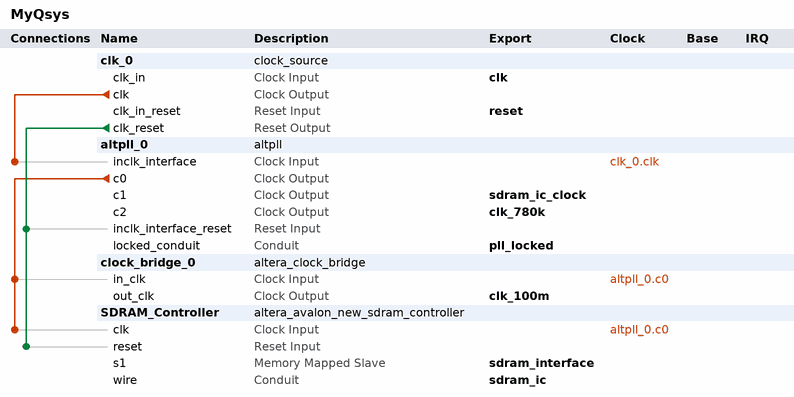
[diagram p0: system contents]
# Platform Designer (Qsys) system MyQsys, MAX 10 10M50DAF484C7G
# Parameters at their usual value, and those the tool derives, are not listed.
package require -exact qsys 16.1
create_system MyQsys
set_project_property DEVICE_FAMILY {MAX 10}
set_project_property DEVICE 10M50DAF484C7G

add_instance clk_0 clock_source 16.1
set_instance_parameter_value clk_0 clockFrequency 50000000

add_instance altpll_0 altpll 16.1
set_instance_parameter_value altpll_0 CLK0_DIVIDE_BY 1
set_instance_parameter_value altpll_0 CLK0_MULTIPLY_BY 2
set_instance_parameter_value altpll_0 CLK1_DIVIDE_BY 1
set_instance_parameter_value altpll_0 CLK1_DUTY_CYCLE 50
set_instance_parameter_value altpll_0 CLK1_MULTIPLY_BY 2
set_instance_parameter_value altpll_0 CLK1_PHASE_SHIFT -2500
set_instance_parameter_value altpll_0 CLK2_DIVIDE_BY 64
set_instance_parameter_value altpll_0 CLK2_DUTY_CYCLE 50
set_instance_parameter_value altpll_0 CLK2_MULTIPLY_BY 1
set_instance_parameter_value altpll_0 CLK2_PHASE_SHIFT 0
set_instance_parameter_value altpll_0 INCLK0_INPUT_FREQUENCY 20000
set_instance_parameter_value altpll_0 PORT_ARESET PORT_UNUSED
set_instance_parameter_value altpll_0 PORT_LOCKED PORT_USED
set_instance_parameter_value altpll_0 PORT_clk1 PORT_USED
set_instance_parameter_value altpll_0 PORT_clk2 PORT_USED
set_instance_parameter_value altpll_0 PORT_clk3 PORT_UNUSED

add_instance clock_bridge_0 altera_clock_bridge 16.1
set_instance_parameter_value clock_bridge_0 DERIVED_CLOCK_RATE 100000000
set_instance_parameter_value clock_bridge_0 EXPLICIT_CLOCK_RATE 0

add_instance SDRAM_Controller altera_avalon_new_sdram_controller 16.1
set_instance_parameter_value SDRAM_Controller TAC 5.4
set_instance_parameter_value SDRAM_Controller TRCD 15.0
set_instance_parameter_value SDRAM_Controller TRP 15.0
set_instance_parameter_value SDRAM_Controller casLatency 3
set_instance_parameter_value SDRAM_Controller columnWidth 10
set_instance_parameter_value SDRAM_Controller dataWidth 16
set_instance_parameter_value SDRAM_Controller generateSimulationModel false
set_instance_parameter_value SDRAM_Controller model single_Micron_MT48LC4M32B2_7_chip
set_instance_parameter_value SDRAM_Controller numberOfBanks 4
set_instance_parameter_value SDRAM_Controller numberOfChipSelects 1
set_instance_parameter_value SDRAM_Controller powerUpDelay 100.0
set_instance_parameter_value SDRAM_Controller refreshPeriod 7.8125
set_instance_parameter_value SDRAM_Controller rowWidth 13

# connections
add_connection altpll_0.c0 clock_bridge_0.in_clk clock
add_connection altpll_0.c0 SDRAM_Controller.clk clock
add_connection clk_0.clk altpll_0.inclk_interface clock
add_connection clk_0.clk_reset altpll_0.inclk_interface_reset reset
add_connection clk_0.clk_reset SDRAM_Controller.reset reset

# exported interfaces
add_interface clk clock sink
set_interface_property clk EXPORT_OF clk_0.clk_in
add_interface clk_100m clock source
set_interface_property clk_100m EXPORT_OF clock_bridge_0.out_clk
add_interface clk_780k clock source
set_interface_property clk_780k EXPORT_OF altpll_0.c2
add_interface pll_locked conduit end
set_interface_property pll_locked EXPORT_OF altpll_0.locked_conduit
add_interface reset reset sink
set_interface_property reset EXPORT_OF clk_0.clk_in_reset
add_interface sdram_ic conduit end
set_interface_property sdram_ic EXPORT_OF SDRAM_Controller.wire
add_interface sdram_ic_clock clock source
set_interface_property sdram_ic_clock EXPORT_OF altpll_0.c1
add_interface sdram_interface avalon slave
set_interface_property sdram_interface EXPORT_OF SDRAM_Controller.s1

set_interconnect_requirement {$system} qsys_mm.clockCrossingAdapter HANDSHAKE
set_interconnect_requirement {$system} qsys_mm.enableEccProtection FALSE
set_interconnect_requirement {$system} qsys_mm.insertDefaultSlave FALSE
set_interconnect_requirement {$system} qsys_mm.maxAdditionalLatency 1

save_system MyQsys.qsys
